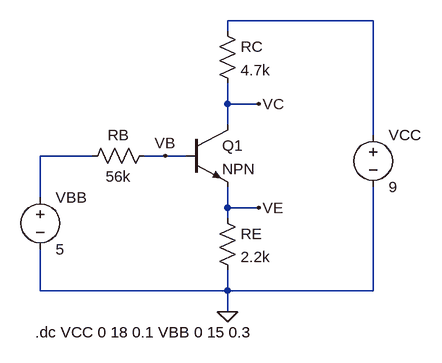
[diagram p0: schematic 3_12_tp3_ej6_pablo_gomez.asc]
3_12_tp3_ej6_pablo_gomez.asc, the LTspice schematic file:
Version 4
SHEET 1 880 680
WIRE 432 16 208 16
WIRE 208 32 208 16
WIRE 208 144 208 112
WIRE 256 144 208 144
WIRE 208 176 208 144
WIRE 432 192 432 16
WIRE 0 224 -80 224
WIRE 112 224 80 224
WIRE 144 224 112 224
WIRE -80 288 -80 224
WIRE 208 304 208 272
WIRE 256 304 208 304
WIRE 208 320 208 304
WIRE -80 432 -80 368
WIRE 208 432 208 400
WIRE 208 432 -80 432
WIRE 432 432 432 272
WIRE 432 432 208 432
WIRE 208 464 208 432
FLAG 256 144 VC
FLAG 256 304 VE
FLAG 112 224 VB
FLAG 208 464 0
SYMBOL res 192 16 R0
SYMATTR InstName RC
SYMATTR Value 4.7k
SYMBOL res 96 208 R90
WINDOW 0 0 56 VBottom 2
WINDOW 3 32 56 VTop 2
SYMATTR InstName RB
SYMATTR Value 56k
SYMBOL res 192 304 R0
SYMATTR InstName RE
SYMATTR Value 2.2k
SYMBOL npn 144 176 R0
SYMATTR InstName Q1
SYMBOL voltage -80 272 R0
WINDOW 123 0 0 Left 0
WINDOW 39 0 0 Left 0
SYMATTR InstName VBB
SYMATTR Value 5
SYMBOL voltage 432 176 R0
WINDOW 123 0 0 Left 0
WINDOW 39 0 0 Left 0
SYMATTR InstName VCC
SYMATTR Value 9
TEXT -88 496 Left 2 !.dc VCC 0 18 0.1 VBB 0 15 0.3

The netlist it stands for:
* 3_12_tp3_ej6_pablo_gomez.asc
RC N001 VC 4.7k
RB VB N002 56k
RE VE 0 2.2k
Q1 VC VB VE 0 NPN
VBB N002 0 5
VCC N001 0 9
.model NPN NPN
.model PNP PNP
.lib standard.bjt
.dc VCC 0 18 0.1 VBB 0 15 0.3
.backanno
.end